# Altium schematic sheet power.SchDoc
size A4
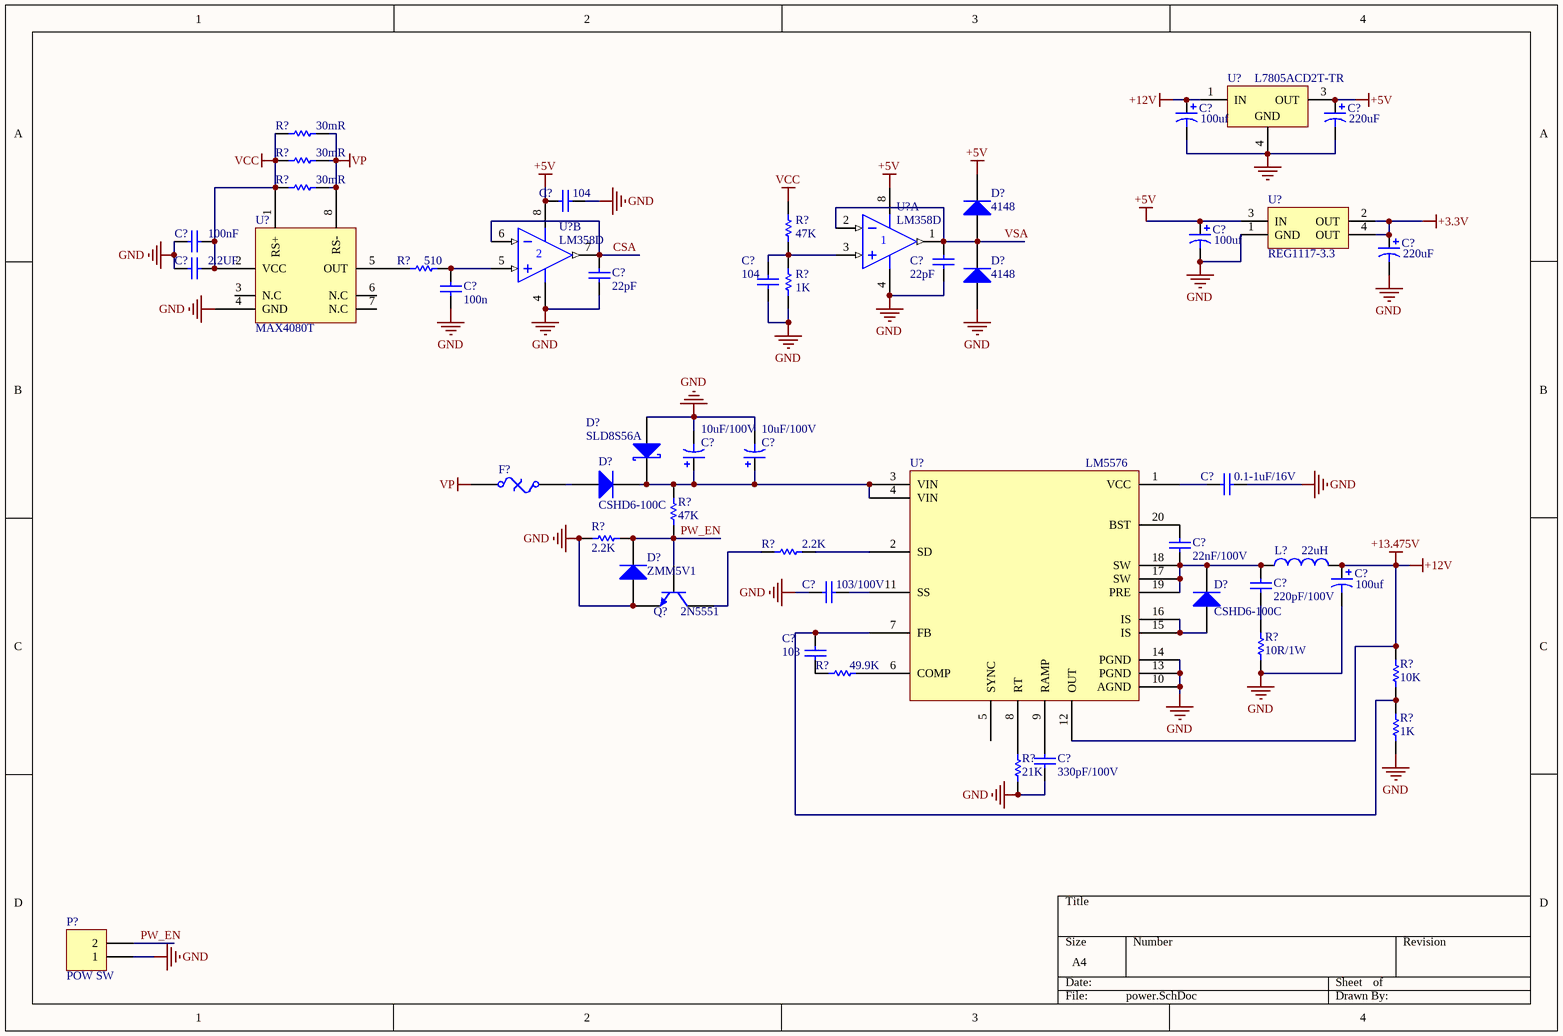
[diagram p0: power.SchDoc]

## Parts
(Parts that share a designator on the sheet are numbered #1, #2 ... from top to bottom, then left to right.)
C?#1  value 100uf  [C8x4]  (hidden comment: Cap Pol1)
C?#2  value 220uF  [C8x4]  (hidden comment: Cap Pol1)
C?#3  value 104  [0603]  (hidden comment: Cap)
C?#4  value 100nF  [R0805]  (hidden comment: Cap)
C?#5  value 100uf  [C8x4]  (hidden comment: Cap Pol1)
C?#6  value 220uF  [C8x4]  (hidden comment: Cap Pol1)
C?#7  value 22pF  [0603]  (hidden comment: Cap)
C?#8  value 104  [0603]  (hidden comment: Cap)
C?#9  value 2.2UF  [C-5.08]  (hidden comment: Cap)
C?#10  value 22pF  [0603]  (hidden comment: Cap)
C?#11  value 100n  [0603]  (hidden comment: Cap)
C?#12  value 10uF/100V  [C10-SMD]  (hidden comment: Cap Pol3)
C?#13  value 10uF/100V  [C10-SMD]  (hidden comment: Cap Pol3)
C?#14  value 0.1-1uF/16V  [0805]  (hidden comment: Cap)
C?#15  value 22nF/100V  [0805]  (hidden comment: Cap)
C?#16  value 100uf  [C8x4]  (hidden comment: Cap Pol1)
C?#17  value 220pF/100V  [0603]  (hidden comment: Cap)
C?#18  value 103/100V  [0603]  (hidden comment: Cap)
C?#19  value 103  [0603]  (hidden comment: Cap)
C?#20  value 330pF/100V  [0603]  (hidden comment: Cap)
D?#1  4148  [LL34]
D?#2  4148  [LL34]
D?#3  SLD8S56A  [SMTO-263]
D?#4  CSHD6-100C  [LL34]
D?#5  ZMM5V1  [LL34]
D?#6  CSHD6-100C  [LL34]
F?  Fuse Thermal  [FUSE-PTC]  (value not drawn)
L?  value 22uH  [L-6045]  (hidden comment: Inductor)
P?  POW SW  [HDR1X2]
Q?  value 2N5551  [SOT-23-NPN]  (hidden comment: NPN)
R?#1  value 30mR  [R15-1mm]
R?#2  value 30mR  [R15-1mm]
R?#3  value 30mR  [R15-1mm]
R?#4  value 47K  [R0805]  (hidden comment: Res1)
R?#5  value 510  [0603]  (hidden comment: Res1)
R?#6  value 1K  [R0805]  (hidden comment: Res1)
R?#7  value 47K  [0805]  (hidden comment: Res1)
R?#8  value 2.2K  [0805]  (hidden comment: Res1)
R?#9  value 2.2K  [0805]  (hidden comment: Res1)
R?#10  value 49.9K  [0603]  (hidden comment: Res1)
R?#11  value 10R/1W  [6332[2512]]  (hidden comment: Res1)
R?#12  value 10K  [0603]  (hidden comment: Res1)
R?#13  value 1K  [0603]  (hidden comment: Res1)
R?#14  value 21K  [0603]  (hidden comment: Res1)
U?#1  L7805ACD2T-TR  [D2PAK]
U?#2  REG1117-3.3  [ZZ311]
U?#3  LM358D  [SOIC8]  (part A of 2)
U?#4  LM358D  [SOIC8]  (part B of 2)
U?#5  MAX4080T  [SOIC8]
U?#6  LM5576  [HTTSOP-20]

## Nets
+3.3V: C?#6.1 U?#2.2(OUT) U?#2.4(OUT)
+5V: C?#2.1 C?#3.2 C?#5.1 D?#1.2(K) U?#1.3(OUT) U?#2.3(IN) U?#3.8(V+) U?#4.8(V+)
+12V: C?#1.1 C?#16.1 L?.2 R?#12.2 U?#1.1(IN) U?#6.12(OUT)  [also labelled +13.475V]
GND: C?#1.2 C?#2.2 C?#3.1 C?#4.1 C?#5.2 C?#6.2 C?#7.1 C?#8.2 C?#9.2 C?#10.1 C?#11.1 C?#12.2 C?#13.2 C?#14.1 C?#16.2 C?#18.2 C?#20.1 D?#2.1(A) D?#3.2(A) D?#5.1(A) P?.1 Q?.1(E) R?#6.1 R?#8.1 R?#11.1 R?#13.1 R?#14.1 U?#1.2(GND) U?#1.4(GND) U?#2.1(GND) U?#3.4(V-) U?#4.4(V-) U?#5.4(GND) U?#6.10(AGND) U?#6.13(PGND) U?#6.14(PGND)
VCC: C?#4.2 C?#9.1 R?#1.2 R?#2.2 R?#3.2 R?#4.2 U?#5.1(RS+) U?#5.2(VCC)
VP: F?.1 R?#1.1 R?#2.1 R?#3.1 U?#5.8(RS-)
CSA: C?#10.2 U?#4.6(IN-) U?#4.7(OUT)
PW_EN: D?#5.2(K) P?.2 Q?.2(B) R?#7.2 R?#8.2
VSA: C?#7.2 D?#1.1(A) D?#2.2(K) U?#3.1(OUT) U?#3.2(IN-)
NetC?#8_1: C?#8.1 R?#4.1 R?#6.2 U?#3.3(IN+)
NetC?#11_2: C?#11.2 R?#5.1 U?#4.5(IN+)
NetC?#12_1: C?#12.1 C?#13.1 D?#3.1(K) D?#4.2(K) R?#7.1 U?#6.3(VIN) U?#6.4(VIN)
NetC?#14_2: C?#14.2 U?#6.1(VCC)
NetC?#15_1: C?#15.1 U?#6.20(BST)
NetC?#15_2: C?#15.2 C?#17.2 D?#6.2(K) L?.1 U?#6.17(SW) U?#6.18(SW) U?#6.19(PRE)
NetC?#17_1: C?#17.1 R?#11.2
NetC?#18_1: C?#18.1 U?#6.11(SS)
NetC?#19_1: C?#19.1 R?#12.1 R?#13.2 U?#6.7(FB)
NetC?#19_2: C?#19.2 R?#10.1
NetC?#20_2: C?#20.2 U?#6.9(RAMP)
NetD?#4_1: D?#4.1(A) F?.2
NetD?#6_1: D?#6.1(A) U?#6.15(IS) U?#6.16(IS)
NetQ?_3: Q?.3(C) R?#9.1
NetR?#5_2: R?#5.2 U?#5.5(OUT)
NetR?#9_2: R?#9.2 U?#6.2(SD)
NetR?#10_2: R?#10.2 U?#6.6(COMP)
NetR?#14_2: R?#14.2 U?#6.8(RT)

Not connected (* = marked no-connect by the designer): U?#5 3(N.C) 6(N.C) 7(N.C); U?#6 5(SYNC)

## Library data of the parts
C?#1 C?#2 C?#5 C?#6 C?#16 = Cap Pol1: Polarized Capacitor (Radial); Published: 8-Jun-2000; LatestRevisionDate: 17-Jul-2002; LatestRevisionNote: Re-released for DXP Platform.; PackageReference: RB7.6-15; Publisher: Altium Limited
C?#3 C?#4 C?#7-C?#11 C?#14 C?#15 C?#17-C?#20 = Cap: Capacitor; Published: 8-Jun-2000; LatestRevisionDate: 17-Jul-2002; LatestRevisionNote: Re-released for DXP Platform.; PackageReference: RAD-0.3; Publisher: Altium Limited
C?#12 C?#13 = Cap Pol3: Polarized Capacitor (Surface Mount); Published: 8-Jun-2000; LatestRevisionDate: 17-Jul-2002; LatestRevisionNote: Re-released for DXP Platform.; PackageReference: C0805; Publisher: Altium Limited
D?#1 D?#2 D?#4-D?#6 = Diode 1N5408: 3 Amp Medium Power Silicon Rectifier Diode; Value: 1N4148; Published: 8-Jun-2000; LatestRevisionDate: 17-Jul-2002; LatestRevisionNote: Re-released for DXP Platform.; DatasheetDocument: Aug-1984; PackageReference: DO-201AD; Publisher: Altium Limited; ComponentLink1Description: Manufacturer Link; ComponentLink1URL: http://www.irf.com/
D?#3 = Diode 18TQ045: Schottky Rectifier; Note: Terminal 2 is the TAB and is electrically connected to the cathode; Value: SMBJ45CA; Published: 8-Jun-2000; LatestRevisionDate: 17-Jul-2002; LatestRevisionNote: Re-released for DXP Platform.; DatasheetDocument: Dec-1997; PackageDocument: Feb-1998; PackageReference: TO-220AC; Publisher: Altium Limited; ComponentLink1Description: Manufacturer Link; ComponentLink1URL: http://www.irf.com/; ComponentLink2Description: Datasheet; ComponentLink2URL: http://www.irf.com/product-info/datasheets/data/18tq.pdf
F? = Fuse Thermal: Thermal Fuse; Published: 24-Mar-1999; LatestRevisionDate: 17-Jul-2002; LatestRevisionNote: Re-released for DXP Platform.; PackageReference: PIN-W2/E2.8; Publisher: Altium Limited
L? = Inductor: Code_IEC: 1005; Published: 8-Jun-2000; LatestRevisionDate: 17-Jul-2002; LatestRevisionNote: Re-released for DXP Platform.; PackageReference: 0402-A; Publisher: Altium Limited; Code_JEITA: 0402
P? = Header 2: Header, 2-Pin; LatestRevisionDate: 17-Jul-2002; LatestRevisionNote: Re-released for DXP Platform.; Publisher: Altium Limited
Q? = 2N5551: NPN General Purpose Amplifier; Published: 8-Jun-2000; LatestRevisionDate: 17-Jan-2003; LatestRevisionNote: PCB Footprint 'BCY-W3/D4.7' replaced; DatasheetDocument: 1997; PackageDocument: Sep-1998; PackageReference: TO-92A; Publisher: Altium Limited; ComponentLink1Description: Manufacturer Link; ComponentLink1URL: http://www.fairchildsemi.com/; ComponentLink2Description: Datasheet; ComponentLink2URL: http://www.fairchildsemi.com/ds/2N%2F2N5551.pdf
R?#1-R?#14 = Res1: Resistor; Published: 8-Jun-2000; LatestRevisionDate: 17-Jul-2002; LatestRevisionNote: Re-released for DXP Platform.; PackageReference: AXIAL-0.3; Publisher: Altium Limited
U?#1 = MC78M05ACDTRK: Three-Terminal Medium Current Positive Voltage Regulator; Note: Pin 2 is electrically connected to Pin 4; Pin 2 is trimmed and not drawn;; Published: 15-Apr-2002; DatasheetVersion: Apr-2000; PackageVersion: 1997; PackageReference: 369A-13; Publisher: Altium Limited; PackageDescription: D-PAK/TO-252-AA; 3 Leads (1 Cropped); Body 10.3 (inc. leads) x 6.7 mm (LxW max); ComponentLink1Description: Manufacturer Link; ComponentLink1URL: http://www.onsemi.com/site/products/taxonomy/0,4438,503,00.html; ComponentLink2Description: Datasheet; ComponentLink2URL: http://www.onsemi.com/pub/Collateral/MC78M00-D.PDF
U?#2 = REG1117-3.3: 800mA and 1A Low Dropout Positive Regulator 2.85V, 3.3V, 5V, and Adjustable; Published: 8-Jun-2000; LatestRevisionDate: 17-Jul-2002; LatestRevisionNote: Re-released for DXP Platform.; DatasheetVersion: Sep-1997; PackageVersion: revC; PackageReference: ZZ311; Publisher: Altium Limited; PackageDescription: SOT-223/SC-73; 4 Leads; Body 6.7 x 7.3 mm, inc. leads (LxW max); ComponentLink1Description: Manufacturer Link; ComponentLink1URL: http://www.ti.com/; ComponentLink2Description: Datasheet; ComponentLink2URL: http://www-s.ti.com/sc/ds/REG1117.pdf
U?#3 U?#4 = LM358D: Dual Low-Power Operational Amplifier; Published: 17-Jul-2002; LatestRevisionDate: 13-Apr-2006; LatestRevisionNote: IPC-7351 Footprint Added.; DatasheetVersion: 1988; PackageReference: 751-02; Publisher: Altium Limited; PackageDescription: 8-Pin Small Outline Integrated Circuit 1.27 mm Pitch; Code_JEDEC: MS-012-AA; Code_IPC: SOIC127P600-8; ComponentLink1Description: Manufacturer Link; ComponentLink1URL: http://www.onsemi.com/site/products/parametrics/0,4446,251,00.html; ComponentLink2Description: Datasheet; ComponentLink2URL: http://www.onsemi.com/pub/Collateral/LM358-D.PDF
U?#5 = MAX4080
U?#6 = LM5576: Value: LM5576